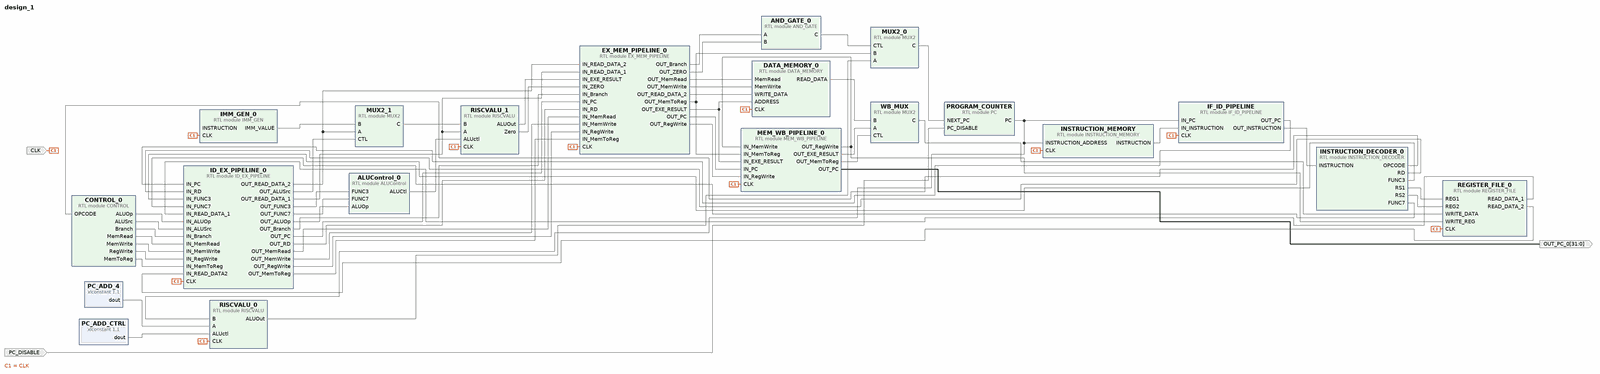
[diagram p0: block diagram of the top level, whole]
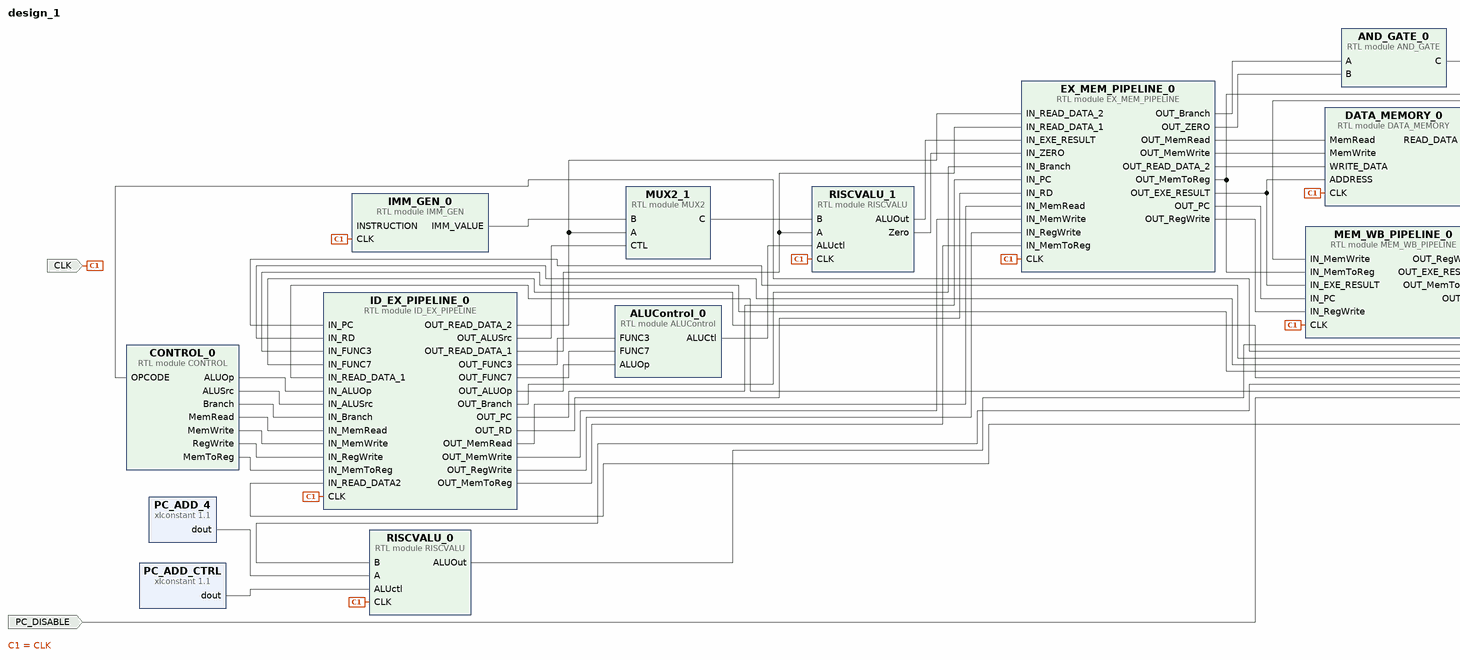
[diagram p1: block diagram of the top level, left part]
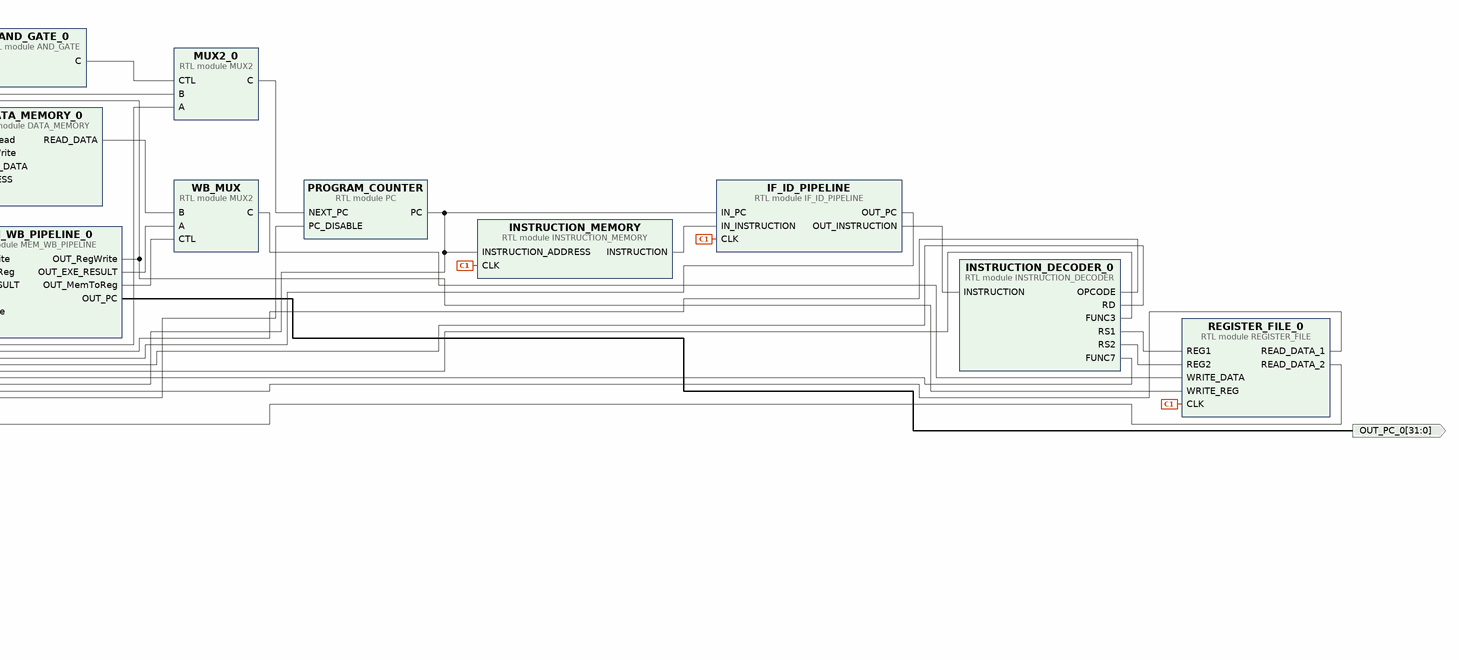
[diagram p2: block diagram of the top level, right part]
# Vivado block design design_1, xc7z020clg400-1, Vivado 2020.2
create_bd_design design_1

create_bd_port -dir I -type clk CLK
create_bd_port -dir O -from 31 -to 0 OUT_PC_0
create_bd_port -dir I PC_DISABLE

create_bd_cell -type ip -vlnv xilinx.com:ip:xlconstant:1.1 PC_ADD_4
set_property -dict {CONFIG.CONST_VAL 4 CONFIG.CONST_WIDTH 32} [get_bd_cells PC_ADD_4]
create_bd_cell -type ip -vlnv xilinx.com:ip:xlconstant:1.1 PC_ADD_CTRL
set_property -dict {CONFIG.CONST_VAL 2 CONFIG.CONST_WIDTH 32} [get_bd_cells PC_ADD_CTRL]
create_bd_cell -type module -reference CONTROL CONTROL_0
create_bd_cell -type module -reference INSTRUCTION_DECODER INSTRUCTION_DECODER_0
create_bd_cell -type module -reference MUX2 MUX2_0
create_bd_cell -type module -reference RISCVALU RISCVALU_0
create_bd_cell -type module -reference IF_ID_PIPELINE IF_ID_PIPELINE
create_bd_cell -type module -reference IMM_GEN IMM_GEN_0
create_bd_cell -type module -reference ALUControl ALUControl_0
create_bd_cell -type module -reference RISCVALU RISCVALU_1
create_bd_cell -type module -reference MUX2 MUX2_1
create_bd_cell -type module -reference AND_GATE AND_GATE_0
create_bd_cell -type module -reference DATA_MEMORY DATA_MEMORY_0
create_bd_cell -type module -reference EX_MEM_PIPELINE EX_MEM_PIPELINE_0
create_bd_cell -type module -reference MUX2 WB_MUX
create_bd_cell -type module -reference MEM_WB_PIPELINE MEM_WB_PIPELINE_0
create_bd_cell -type module -reference PC PROGRAM_COUNTER
create_bd_cell -type module -reference INSTRUCTION_MEMORY INSTRUCTION_MEMORY
create_bd_cell -type module -reference REGISTER_FILE REGISTER_FILE_0
create_bd_cell -type module -reference ID_EX_PIPELINE ID_EX_PIPELINE_0

# ---- connections ----

connect_bd_net -net PC_0_PC [get_bd_pins PROGRAM_COUNTER/PC] \
  [get_bd_pins RISCVALU_0/B] [get_bd_pins IF_ID_PIPELINE/IN_PC] [get_bd_pins INSTRUCTION_MEMORY/INSTRUCTION_ADDRESS]
connect_bd_net [get_bd_pins MUX2_0/C] [get_bd_pins PROGRAM_COUNTER/NEXT_PC]
connect_bd_net [get_bd_pins RISCVALU_0/ALUOut] [get_bd_pins MUX2_0/A]
connect_bd_net -net xlconstant_0_dout [get_bd_pins PC_ADD_4/dout] [get_bd_pins RISCVALU_0/A]
connect_bd_net [get_bd_pins PC_ADD_CTRL/dout] [get_bd_pins RISCVALU_0/ALUctl]
connect_bd_net -net CLK_0_1 [get_bd_ports CLK] \
  [get_bd_pins RISCVALU_0/CLK] [get_bd_pins IF_ID_PIPELINE/CLK] [get_bd_pins IMM_GEN_0/CLK] [get_bd_pins RISCVALU_1/CLK] \
  [get_bd_pins DATA_MEMORY_0/CLK] [get_bd_pins EX_MEM_PIPELINE_0/CLK] [get_bd_pins MEM_WB_PIPELINE_0/CLK] \
  [get_bd_pins INSTRUCTION_MEMORY/CLK] [get_bd_pins REGISTER_FILE_0/CLK] [get_bd_pins ID_EX_PIPELINE_0/CLK]
connect_bd_net -net IF_ID_PIPELINE_0_OUT_INSTRUCTION [get_bd_pins IF_ID_PIPELINE/OUT_INSTRUCTION] [get_bd_pins INSTRUCTION_DECODER_0/INSTRUCTION]
connect_bd_net [get_bd_pins INSTRUCTION_DECODER_0/OPCODE] [get_bd_pins CONTROL_0/OPCODE]
connect_bd_net [get_bd_pins IF_ID_PIPELINE/OUT_PC] [get_bd_pins ID_EX_PIPELINE_0/IN_PC]
connect_bd_net [get_bd_pins INSTRUCTION_DECODER_0/RD] [get_bd_pins ID_EX_PIPELINE_0/IN_RD]
connect_bd_net [get_bd_pins INSTRUCTION_DECODER_0/FUNC3] [get_bd_pins ID_EX_PIPELINE_0/IN_FUNC3]
connect_bd_net [get_bd_pins INSTRUCTION_DECODER_0/FUNC7] [get_bd_pins ID_EX_PIPELINE_0/IN_FUNC7]
connect_bd_net [get_bd_pins CONTROL_0/ALUOp] [get_bd_pins ID_EX_PIPELINE_0/IN_ALUOp]
connect_bd_net [get_bd_pins CONTROL_0/ALUSrc] [get_bd_pins ID_EX_PIPELINE_0/IN_ALUSrc]
connect_bd_net [get_bd_pins CONTROL_0/Branch] [get_bd_pins ID_EX_PIPELINE_0/IN_Branch]
connect_bd_net [get_bd_pins CONTROL_0/MemRead] [get_bd_pins ID_EX_PIPELINE_0/IN_MemRead]
connect_bd_net [get_bd_pins CONTROL_0/MemWrite] [get_bd_pins ID_EX_PIPELINE_0/IN_MemWrite]
connect_bd_net [get_bd_pins CONTROL_0/RegWrite] [get_bd_pins ID_EX_PIPELINE_0/IN_RegWrite]
connect_bd_net [get_bd_pins CONTROL_0/MemToReg] [get_bd_pins ID_EX_PIPELINE_0/IN_MemToReg]
connect_bd_net -net INSTRUCTION_MEMORY_0_INSTRUCTION [get_bd_pins INSTRUCTION_MEMORY/INSTRUCTION] [get_bd_pins IF_ID_PIPELINE/IN_INSTRUCTION]
connect_bd_net [get_bd_pins INSTRUCTION_DECODER_0/RS1] [get_bd_pins REGISTER_FILE_0/REG1]
connect_bd_net [get_bd_pins INSTRUCTION_DECODER_0/RS2] [get_bd_pins REGISTER_FILE_0/REG2]
connect_bd_net [get_bd_pins REGISTER_FILE_0/READ_DATA_1] [get_bd_pins ID_EX_PIPELINE_0/IN_READ_DATA_1]
connect_bd_net [get_bd_pins REGISTER_FILE_0/READ_DATA_2] [get_bd_pins ID_EX_PIPELINE_0/IN_READ_DATA2]
# net ID_EX_PIPELINE_0_OUT_INSTRUCTION has one end: IMM_GEN_0/INSTRUCTION
connect_bd_net [get_bd_pins ID_EX_PIPELINE_0/OUT_FUNC3] [get_bd_pins ALUControl_0/FUNC3]
connect_bd_net [get_bd_pins ID_EX_PIPELINE_0/OUT_FUNC7] [get_bd_pins ALUControl_0/FUNC7]
connect_bd_net [get_bd_pins ID_EX_PIPELINE_0/OUT_ALUOp] [get_bd_pins ALUControl_0/ALUOp]
connect_bd_net [get_bd_pins ID_EX_PIPELINE_0/OUT_ALUSrc] [get_bd_pins MUX2_1/CTL]
connect_bd_net [get_bd_pins IMM_GEN_0/IMM_VALUE] [get_bd_pins MUX2_1/B]
connect_bd_net [get_bd_pins ID_EX_PIPELINE_0/OUT_READ_DATA_1] [get_bd_pins RISCVALU_1/A] [get_bd_pins EX_MEM_PIPELINE_0/IN_READ_DATA_1]
connect_bd_net [get_bd_pins ID_EX_PIPELINE_0/OUT_READ_DATA_2] [get_bd_pins MUX2_1/A] [get_bd_pins EX_MEM_PIPELINE_0/IN_READ_DATA_2]
connect_bd_net [get_bd_pins MUX2_1/C] [get_bd_pins RISCVALU_1/B]
connect_bd_net [get_bd_pins ALUControl_0/ALUCtl] [get_bd_pins RISCVALU_1/ALUctl]
connect_bd_net [get_bd_pins ID_EX_PIPELINE_0/OUT_Branch] [get_bd_pins EX_MEM_PIPELINE_0/IN_Branch]
connect_bd_net [get_bd_pins ID_EX_PIPELINE_0/OUT_PC] [get_bd_pins EX_MEM_PIPELINE_0/IN_PC]
connect_bd_net [get_bd_pins ID_EX_PIPELINE_0/OUT_RD] [get_bd_pins EX_MEM_PIPELINE_0/IN_RD]
connect_bd_net [get_bd_pins RISCVALU_1/ALUOut] [get_bd_pins EX_MEM_PIPELINE_0/IN_EXE_RESULT]
connect_bd_net [get_bd_pins ID_EX_PIPELINE_0/OUT_MemRead] [get_bd_pins EX_MEM_PIPELINE_0/IN_MemRead]
connect_bd_net [get_bd_pins ID_EX_PIPELINE_0/OUT_MemWrite] [get_bd_pins EX_MEM_PIPELINE_0/IN_MemWrite]
connect_bd_net [get_bd_pins ID_EX_PIPELINE_0/OUT_RegWrite] [get_bd_pins EX_MEM_PIPELINE_0/IN_RegWrite]
connect_bd_net [get_bd_pins ID_EX_PIPELINE_0/OUT_MemToReg] [get_bd_pins EX_MEM_PIPELINE_0/IN_MemToReg]
connect_bd_net [get_bd_pins RISCVALU_1/Zero] [get_bd_pins EX_MEM_PIPELINE_0/IN_ZERO]
connect_bd_net [get_bd_pins EX_MEM_PIPELINE_0/OUT_Branch] [get_bd_pins AND_GATE_0/A]
connect_bd_net [get_bd_pins EX_MEM_PIPELINE_0/OUT_ZERO] [get_bd_pins AND_GATE_0/B]
connect_bd_net [get_bd_pins AND_GATE_0/C] [get_bd_pins MUX2_0/CTL]
connect_bd_net [get_bd_pins EX_MEM_PIPELINE_0/OUT_MemRead] [get_bd_pins DATA_MEMORY_0/MemRead]
connect_bd_net [get_bd_pins EX_MEM_PIPELINE_0/OUT_MemWrite] [get_bd_pins DATA_MEMORY_0/MemWrite]
connect_bd_net [get_bd_pins EX_MEM_PIPELINE_0/OUT_EXE_RESULT] [get_bd_pins DATA_MEMORY_0/ADDRESS] [get_bd_pins MEM_WB_PIPELINE_0/IN_EXE_RESULT]
connect_bd_net [get_bd_pins EX_MEM_PIPELINE_0/OUT_READ_DATA_2] [get_bd_pins DATA_MEMORY_0/WRITE_DATA]
connect_bd_net [get_bd_pins MEM_WB_PIPELINE_0/OUT_EXE_RESULT] [get_bd_pins WB_MUX/A]
connect_bd_net [get_bd_pins DATA_MEMORY_0/READ_DATA] [get_bd_pins WB_MUX/B]
connect_bd_net [get_bd_pins EX_MEM_PIPELINE_0/OUT_PC] [get_bd_pins MEM_WB_PIPELINE_0/IN_PC]
connect_bd_net -net MUX2_2_C [get_bd_pins WB_MUX/C] [get_bd_pins REGISTER_FILE_0/WRITE_DATA]
connect_bd_net [get_bd_pins EX_MEM_PIPELINE_0/OUT_RegWrite] [get_bd_pins MEM_WB_PIPELINE_0/IN_RegWrite]
connect_bd_net [get_bd_pins EX_MEM_PIPELINE_0/OUT_MemToReg] [get_bd_pins MEM_WB_PIPELINE_0/IN_MemToReg] [get_bd_pins MUX2_0/B]
connect_bd_net [get_bd_pins MEM_WB_PIPELINE_0/OUT_MemToReg] [get_bd_pins WB_MUX/CTL]
connect_bd_net [get_bd_pins MEM_WB_PIPELINE_0/OUT_PC] [get_bd_ports OUT_PC_0]
connect_bd_net [get_bd_pins MEM_WB_PIPELINE_0/OUT_RegWrite] [get_bd_pins MEM_WB_PIPELINE_0/IN_MemWrite] [get_bd_pins REGISTER_FILE_0/WRITE_REG]
connect_bd_net -net PC_DISABLE_0_1 [get_bd_ports PC_DISABLE] [get_bd_pins PROGRAM_COUNTER/PC_DISABLE]

validate_bd_design
save_bd_design
